# EAGLE design MicroViewUSB (EAGLE 6.5.0)
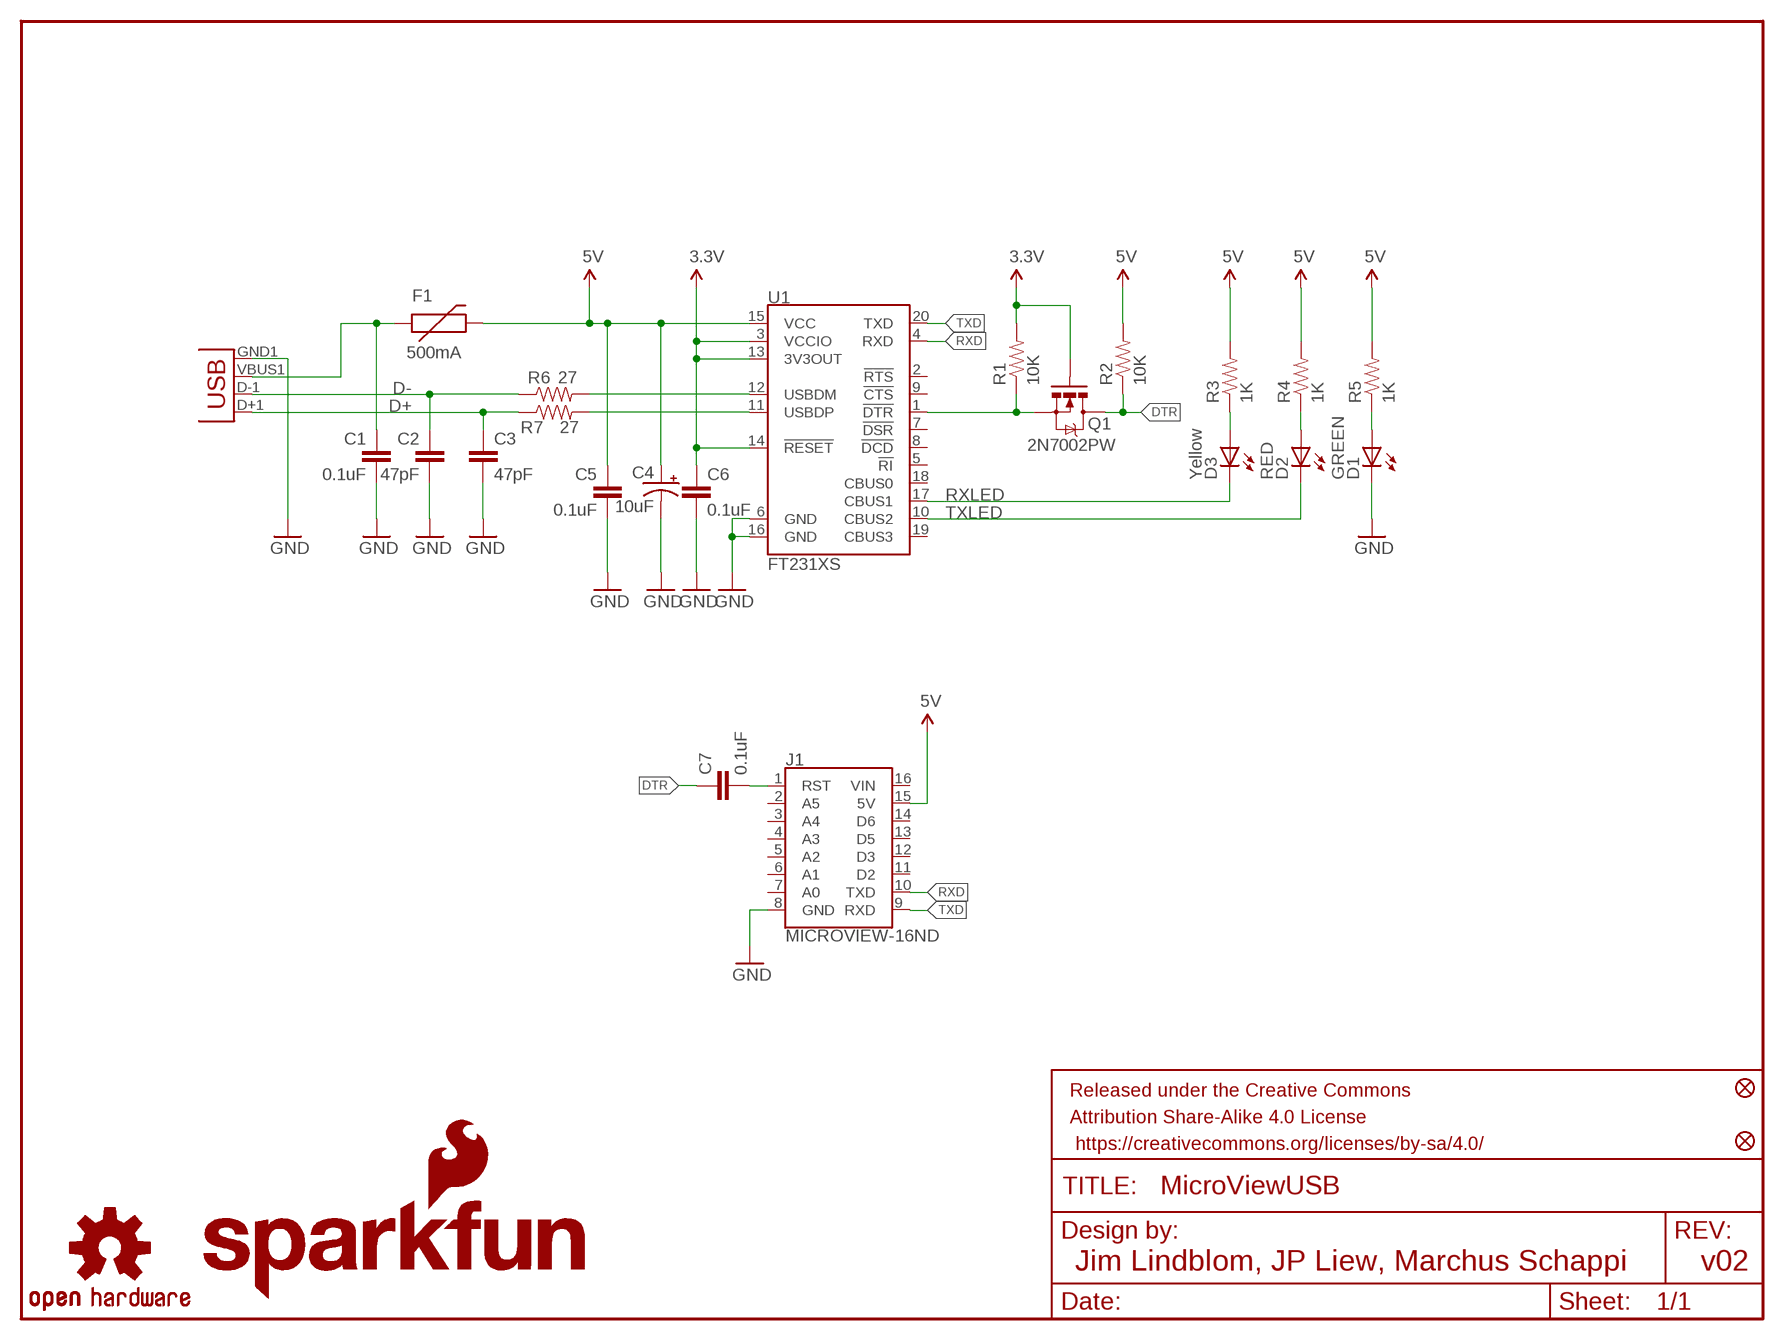
[diagram p0: schematic, sheet 1]

## Parts
C1  0.1uF  0.1UF-25V(+80/-20%)(0603)  [0603-CAP]
C2  47pF  47PF-50V-5%(0603)  [0603-CAP]
C3  47pF  47PF-50V-5%(0603)  [0603-CAP]
C4  10uF  10UF-16V-10%(TANT)  [EIA3216]
C5  0.1uF  0.1UF-25V(+80/-20%)(0603)  [0603-CAP]
C6  0.1uF  0.1UF-25V(+80/-20%)(0603)  [0603-CAP]
C7  0.1uF  0.1UF-25V(+80/-20%)(0603)  [0603-CAP]
D1  GREEN  LED-GREENLARGE  [LED-1206]
D2  RED  LED-RED1206  [LED-1206]
D3  Yellow  LED-YELLOWLILYPAD  [LED-1206]
F1  500mA  PTCSMD-W  [PTC-1206-WIDE]
FID1  FIDUCIAL1X2  [FIDUCIAL-1X2]
FID2  FIDUCIAL1X2  [FIDUCIAL-1X2]
FRAME1  FRAME-LETTER  [CREATIVE_COMMONS]
J1  MICROVIEW-16ND  [MV-DIP16-NODIMENSION]
JP1  USBA-SMD-MALE  [USB-A-SMT-MALE]
LOGO1  SFE_LOGO_FLAME.1_INCH  [SFE_LOGO_FLAME_.1]
LOGO2  OSHW-LOGOS  [OSHW-LOGO-S]
LOGO3  SFE_LOGO_NAME_FLAME.1_INCH  [SFE_LOGO_NAME_FLAME_.1]
Q1  2N7002PW  MOSFET-NCHANNEL2N7002PW  [SOT323]
R1  10K  10KOHM1/10W1%(0603)0603  [0603-RES]
R2  10K  10KOHM1/10W1%(0603)0603  [0603-RES]
R3  1K  1KOHM1/10W1%(0603)  [0603-RES]
R4  1K  1KOHM1/10W1%(0603)  [0603-RES]
R5  1K  1KOHM1/10W1%(0603)  [0603-RES]
R6  27  RESISTOR0603-RES  [0603-RES]
R7  27  RESISTOR0603-RES  [0603-RES]
U1  FT231XS  [SSOP20_L]

## Nets
3.3V: C6.1 Q1.1(G) R1.2 U1.3(VCCIO) U1.13(3V3OUT) U1.14(!RESET)
5V: C4.A(+) C5.1 F1.2 J1.15(5V) R2.2 R3.2 R4.2 R5.2 U1.15(VCC)
D+: C3.1 JP1.D+1(D+) R7.1
D-: C2.1 JP1.D-1(D-) R6.1
DTR: C7.1 Q1.3(D) R2.1
GND: C1.2 C2.2 C3.2 C4.C(-) C5.2 C6.2 D1.C J1.8(GND) JP1.GND1(GND) U1.6(GND) U1.16(GND)
N$1: D1.A R5.1
N$2: C7.2 J1.1(RST)
N$6: R6.2 U1.12(USBDM)
N$7: R7.2 U1.11(USBDP)
N$8: D2.A R4.1
N$10: D3.A R3.1
N$12: Q1.2(S) R1.1 U1.1(!DTR)
RXD: J1.10(TXD) U1.4(RXD)
RXLED: D3.C U1.17(CBUS1)
TXD: J1.9(RXD) U1.20(TXD)
TXLED: D2.C U1.10(CBUS2)
VUSB: C1.1 F1.1 JP1.VBUS1(VBUS)
Unconnected: J1.2(A5) J1.3(A4) J1.4(A3) J1.5(A2) J1.6(A1) J1.7(A0) J1.11(D2) J1.12(D3) J1.13(D5) J1.14(D6) J1.16(VIN) U1.2(!RTS) U1.5(!RI) U1.7(!DSR) U1.8(!DCD) U1.9(!CTS) U1.18(CBUS0) U1.19(CBUS3)

## Notes on the sheet
- Jim Lindblom, JP Liew, Marchus Schappi | v02

## Library data of the parts
C1 C5-C7 = SparkFun-Capacitors:0.1UF-25V(+80/-20%)(0603): CAP-00810 Ceramic Standard decoupling cap; PROD_ID: CAP-00810
C2 C3 = SparkFun-Capacitors:47PF-50V-5%(0603): CAP-08913; PROD_ID: CAP-08913
C4 = SparkFun-Capacitors:10UF-16V-10%(TANT): CAP-00811 1206/EIA-3216 Tantalum capacitor; PROD_ID: CAP-00811
D1 = SparkFun-LED:LED-GREEN: Various green LEDs Green LEDs used in SFE Production 0603- DIO-00821 LARGE- DIO-00862 LILYPAD- DIO-09910; PROD_ID: DIO-00862
D2 = SparkFun-LED:LED-RED: Assorted Red LEDs LilyPad 1206- DIO-09912 1206- DIO-00809 0603- DIO-00819; PROD_ID: DIO-00809
D3 = SparkFun-LED:LED-YELLOW: Yellow SMD LEDs LilyPad 1206- DIO-09909 0603- DIO-09003; PROD_ID: DIO-09909
F1 = SparkFun-PowerIC:PTC: Resettable Fuse PTC Resettable Fuse. Spark Fun Electronics SKU : COM-08357
FID1 FID2 = SparkFun-Aesthetics:FIDUCIAL: Fiducial Alignment Points Various fiducial points for machine vision alignment.
FRAME1 = SparkFun-Aesthetics:FRAME-LETTER: Schematic Frame Standard 8.5x11 US Letter frame
J1 = microView-temp:MICROVIEW-16
JP1 = microView-temp:USB: USB Connectors USB-B-PTH is fully proven SKU : PRT-00139/CONN-08278 USB-miniB is fully proven SKU : PRT-00587 USB-A-PCB is untested. USB-A-H is throughly reviewed, but untested. Spark Fun Electronics SKU : PRT-00437 USB-B-SMT is throughly reviewed, but untested. Needs silkscreen touching up. USB-A-S has not been used/tested USB-MB-H has not been used/tested USB-MICROB has been used. CONN-09505
LOGO1 = SparkFun-Aesthetics:SFE_LOGO_FLAME: SFE Logo, flame only This is the SparkFun flame logo. The logo on the schematic will always be the same size; the package variant is the height of the flame. Default layer for the logo on the board is tSilk.
LOGO2 = SparkFun-Aesthetics:OSHW-LOGO: Open Source Hardware Logo This logo indicates the piece of hardware it is found on incorporates a OSHW license and/or adheres to the definition of open source hardware found here: http://freedomdefined.org/OSHW
LOGO3 = SparkFun-Aesthetics:SFE_LOGO_NAME_FLAME: SFE Logo, name and flame This is the SparkFun full logo. The logo on the schematic will always be the same size; the package variant is the height of the flame part of the logo. Default layer for the logo on the board is tSilk.
Q1 = SparkFun-DiscreteSemi:MOSFET-NCHANNEL: Common NMOSFET Parts MFG P/N Store ID Prod ID FDD8780 TRANS-09984 SI7820DN TRANS-11055 FDS6630A IC-08089 2N7002PW TRANS-11151 FQP30N06L COM-10213 TRANS-10060 BSS123LT1G TRANS-08345 BSS138 TRANS-00830 BS170 2N7000; PROD_ID: TRANS-11151
R1 R2 = SparkFun-Resistors:10KOHM1/10W1%(0603): RES-00824; PROD_ID: RES-00824
R3-R5 = SparkFun-Resistors:1KOHM1/10W1%(0603): RES-07856; PROD_ID: RES-07856
R6 R7 = SparkFun-Resistors:RESISTOR: Resistor Basic schematic elements and footprints for 0603, 1206, and PTH resistors.
U1 = SparkFun-DigitalIC:FT231X: FTDI FT231X Full Speed USB to Full-handshake UART This USB2.0 Full Speed IC offers a compact bridge to full handshake UART interfaces. The device is a UART, capable of operating up to 3MBaud, with low power consumption (8mA). The FT231X includes the complete FT-X series feature set and enables USB to be added into a system design quickly and easily over a UART interface.

## Net classes
0 default: width 0.152 mm, drill 0.305 mm, clearance 0.152 mm

## Board
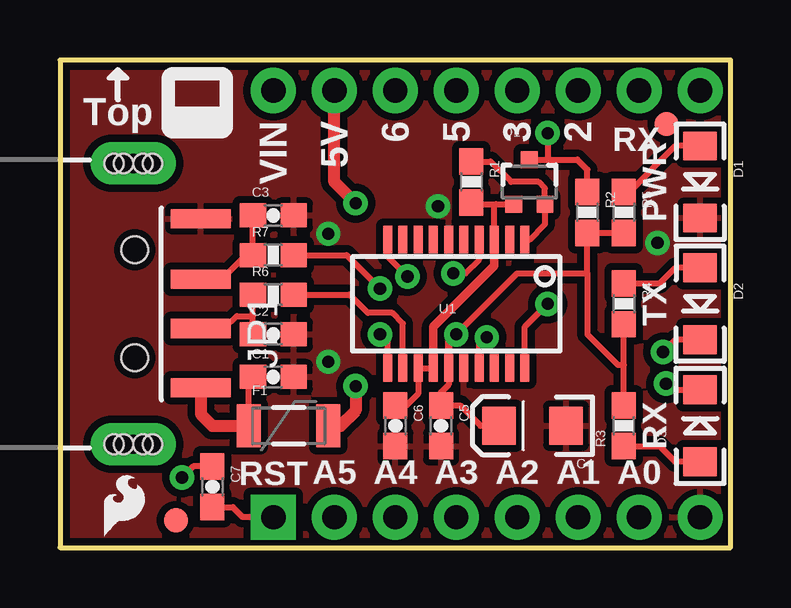
[diagram p1: board, top side]
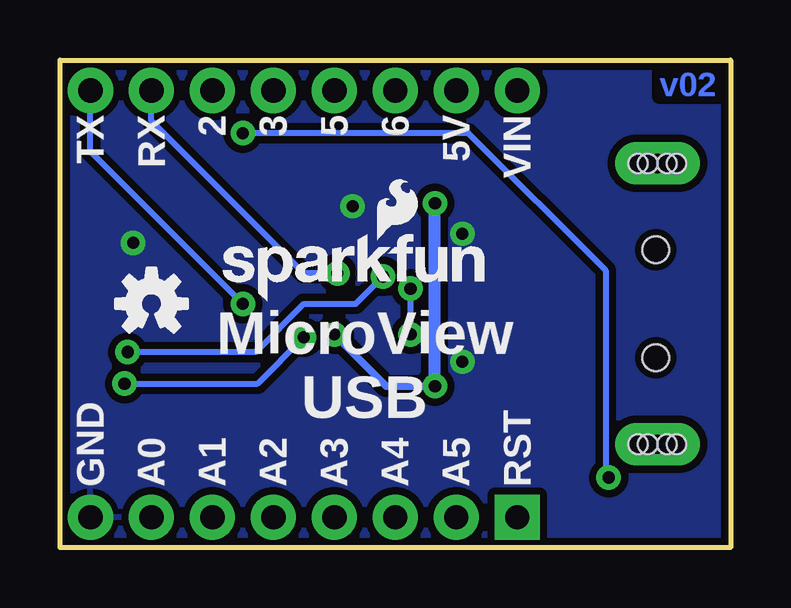
[diagram p2: board, bottom side, seen from below]

Size 27.94 x 20.32 mm. Coordinates in mm from the lower left corner, seen from the top.
Outline: 0,0 27.94,0 27.94,20.32 0,20.32 0,0
Copper layers (1*16): Top 0.035mm / dielectric 1.5mm / Bottom 0.035mm
Design rules "SparkFun-2-layer": minimum track width 7mil, minimum drill 15mil, track to track 8mil, track to pad 8mil, pad to pad 8mil, via to via 8mil, smd to smd 8mil, copper to edge 8mil, drill to drill 8mil, minimum pad ring 12mil, minimum via ring 10mil, stop-mask expansion 4mil, vias tented up to drill 20mil, thermal gap 10mil

### Footprints (pad centres in the part's own frame; a part is rotated, then mirrored left to right if it is on the bottom)
0603-CAP = smd 1.1 x 1: 1 -0.85,0; 2 0.85,0
EIA3216 = smd 1.4 x 1.6: A 1.4,0; C -1.4,0
LED-1206 = smd 1.2 x 1.4: A -1.5,0; C 1.5,0
PTC-1206-WIDE = smd 1 x 1.8: 1 -1.654,0; 2 1.654,0
FIDUCIAL-1X2 = smd 1 x 1: 1 0,0
MV-DIP16-NODIMENSION = drill 1.016 pad 1.88 square: 1 0,0 | drill 1.016 pad 1.88: 2 2.54,0; 3 5.08,0; 4 7.62,0; 5 10.16,0; 6 12.7,0; 7 15.24,0; 8 17.78,0; 9 17.78,17.78; 10 15.24,17.78; 11 12.7,17.78; 12 10.16,17.78; 13 7.62,17.78; 14 5.08,17.78; 15 2.54,17.78; 16 0,17.78
USB-A-SMT-MALE = smd 0.8 x 2.5: D+1 1.027,-5.87; D-1 -1.027,-5.87; GND1 3.551,-5.87; VBUS1 -3.5,-5.87 | drill 0.8 pad 1.778 long: P$1 5.85,-3.05; P$3 -5.85,-3.05 | hole 1.1: 2.25,-3.12; -2.25,-3.12 | hole 0.8: -5.85,-3.45; -5.85,-3.85; -5.85,-2.65; -5.85,-2.25; 5.85,-3.45; 5.85,-3.85; 5.85,-2.65; 5.85,-2.25
SOT323 = smd 0.7 x 0.7: 1 -0.65,-0.925; 2 0.65,-0.925; 3 0,0.925
0603-RES = smd 1.1 x 1: 1 -0.85,0; 2 0.85,0
SSOP20_L = smd 0.381 x 1.143: 1 -2.857,-2.68; 2 -2.223,-2.68; 3 -1.587,-2.68; 4 -0.953,-2.68; 5 -0.318,-2.68; 6 0.318,-2.68; 7 0.953,-2.68; 8 1.587,-2.68; 9 2.223,-2.68; 10 2.857,-2.68; 11 2.857,2.68; 12 2.223,2.68; 13 1.587,2.68; 14 0.953,2.68; 15 0.318,2.68; 16 -0.318,2.68; 17 -0.953,2.68; 18 -1.587,2.68; 19 -2.223,2.68; 20 -2.857,2.68

### Placement (x,y rotation side)
C1  8.89,7.11 0 top
C2  8.89,8.89 0 top
C3  8.89,13.84 0 top
C4  19.68,5.08 180 top
C5  15.88,5.08 270 top
C6  13.97,5.08 270 top
C7  6.35,2.54 270 top
D1  26.67,15.24 270 top
D2  26.67,10.16 270 top
D3  26.67,5.08 90 top
F1  9.53,5.08 0 top
FID1  4.83,1.14 0 top
FID2  25.27,17.65 0 top
FRAME1  -2.54,-10.16 0 top  (outside the outline)
J1  8.89,1.27 0 top
JP1  0,10.16 90 top
LOGO1  1.52,0.13 0 top
LOGO2  24.13,10.16 0 bottom
LOGO3  21.59,10.16 0 bottom
Q1  19.56,15.24 0 top
R1  17.14,15.24 270 top
R2  21.97,13.97 270 top
R3  23.5,5.08 90 top
R4  23.5,10.16 270 top
R5  23.5,13.97 270 top
R6  8.89,10.54 0 top
R7  8.89,12.19 0 top
U1  16.51,10.16 180 top

### Tracks (layer width: path | path; a pad name or v marks a point on that pad's centre or on a via)
3.3V
  Top 0.254: U1.14 U1.13 14.92,6.41 14.44,5.93 C6.1 | R1.2 17.22,14.31 18.16,14.31 | 18.16,14.31 Q1.1 | U1.3 18.1,14.25 18.16,14.31
  Top 0.356: U1.14 15.56,9.21 18.1,11.75 U1.3
5V  (via drill 0.51)
  Top 0.254: U1.15 16.19,6.79 15.88,6.48 C5.1 16.68,5.93 17.53,5.08 C4.A | v16.51,8.89 19.05,11.43 21.97,11.43 | R3.2 23.5,7.62 | 23.5,7.62 R4.2 | 23.5,7.62 23.24,7.62 21.97,8.89 21.97,11.43 | R5.2 R2.2 21.97,11.43
  Top 0.305: U1.15 16.19,8.57 v16.51,8.89
  Top 0.508: v12.32,6.73 12.32,5.71 11.68,5.08 F1.2 | v12.32,14.35 11.43,15.24 J1.15
  Bottom 0.305: v12.32,6.73 14.35,6.73 v16.51,8.89
  Bottom 0.508: v12.32,6.73 v12.32,14.35
D+
  Top 0.254: R7.1 C3.1 | R7.1 7.62,12.19 | JP1.D+1 6.74,11.19 7.75,12.19 R7.1
D-
  Top 0.254: C2.1 8.04,9.65 | 8.04,9.65 R6.1 | 8.04,9.65 7.37,9.65 6.85,9.13 JP1.D-1
DTR  (via drill 0.51)
  Top 0.254: Q1.3 20.32,16.16 | v20.32,17.27 20.32,16.16 | 20.32,16.16 21.55,16.16 21.97,15.75 R2.1 | C7.1 5.55,3.39 v5.08,2.92
  Bottom 0.254: v20.32,17.27 10.92,17.27 5.21,11.56 5.21,3.05 v5.08,2.92
GND  (via drill 0.51)
  other vias: 15.75,14.22 11.18,7.75 11.18,13.08 24.89,12.7
  pour Top (isolate 0.305): 0,20.32 0,0 27.94,0 27.94,20.32
  pour Bottom (isolate 0.305): 0,20.32 0,0 27.94,0 27.94,20.32
N$1
  Top 0.254: D1.A 25.63,16.74 23.71,14.82 R5.1
N$2
  Top 0.254: C7.2 7.2,1.69 7.62,1.27 J1.1
N$6
  Top 0.254: U1.12 14.29,9.34 13.84,9.78 12.83,9.78 12.06,10.54 R6.2
N$7  (via drill 0.51)
  Top 0.254: U1.11 13.65,8.57 v13.34,8.89 | v13.34,10.79 11.94,12.19 R7.2
  Bottom 0.254: v13.34,8.89 v13.34,10.79
N$8
  Top 0.254: R4.1 24.98,11.01 25.63,11.66 D2.A
N$10
  Top 0.254: R3.1 24.98,4.23 25.63,3.58 D3.A
N$12
  Top 0.254: U1.1 19.57,12.84 20.21,13.48 Q1.2 20.21,14.97 19.94,15.24 18.8,15.24 17.95,16.09 R1.1
RXD  (via drill 0.51)
  Top 0.254: U1.4 17.46,12 16.89,11.43 v16.38,11.43
  Bottom 0.254: v16.38,11.43 17.78,11.43 24.13,17.78 J1.10
RXLED  (via drill 0.51)
  Top 0.254: v25.25,6.83 25.5,6.58 D3.C | U1.17 17.46,8.45 v17.78,8.76
  Bottom 0.254: v25.25,6.83 19.71,6.83 v17.78,8.76
TXD  (via drill 0.51)
  Top 0.254: U1.20 19.37,9.21 v20.32,10.16
  Bottom 0.254: v20.32,10.16 26.67,16.51 J1.9
TXLED  (via drill 0.51)
  Top 0.254: v14.48,11.3 13.65,12.13 U1.10 | D2.C 25.63,8.66 v25.12,8.15
  Bottom 0.254: v14.48,11.3 15.62,10.16 17.78,10.16 19.79,8.15 v25.12,8.15
VUSB
  Top 0.254: F1.1 7.87,6.94 C1.1
  Top 0.508: JP1.VBUS1 5.87,5.56 6.35,5.08 F1.1

### Text on the board
Bottom: v02
tPlace: Top | VIN | 5V | 6 | 5 | 3 | 2 | RX | PWR | TX | RX | RST | A5 | A4 | A3 | A2 | A1 | A0
bPlace: VIN | 5V | 6 | 5 | 3 | 2 | RX | TX | MicroView / USB | RST | A5 | A4 | A3 | A2 | A1 | A0 | GND
tDocu: Jim Lindblom, JP Liew, Marcus Schappi